# Altium schematic sheet all_see.SchDoc
size A4
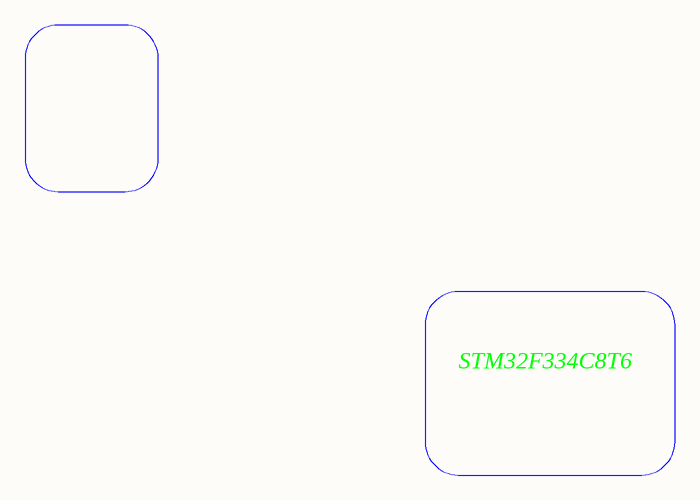
[diagram p0: all_see.SchDoc]

## Notes on the sheet
- STM32F334C8T6